# EasyEDA Pro project drive.epro, board PCB1
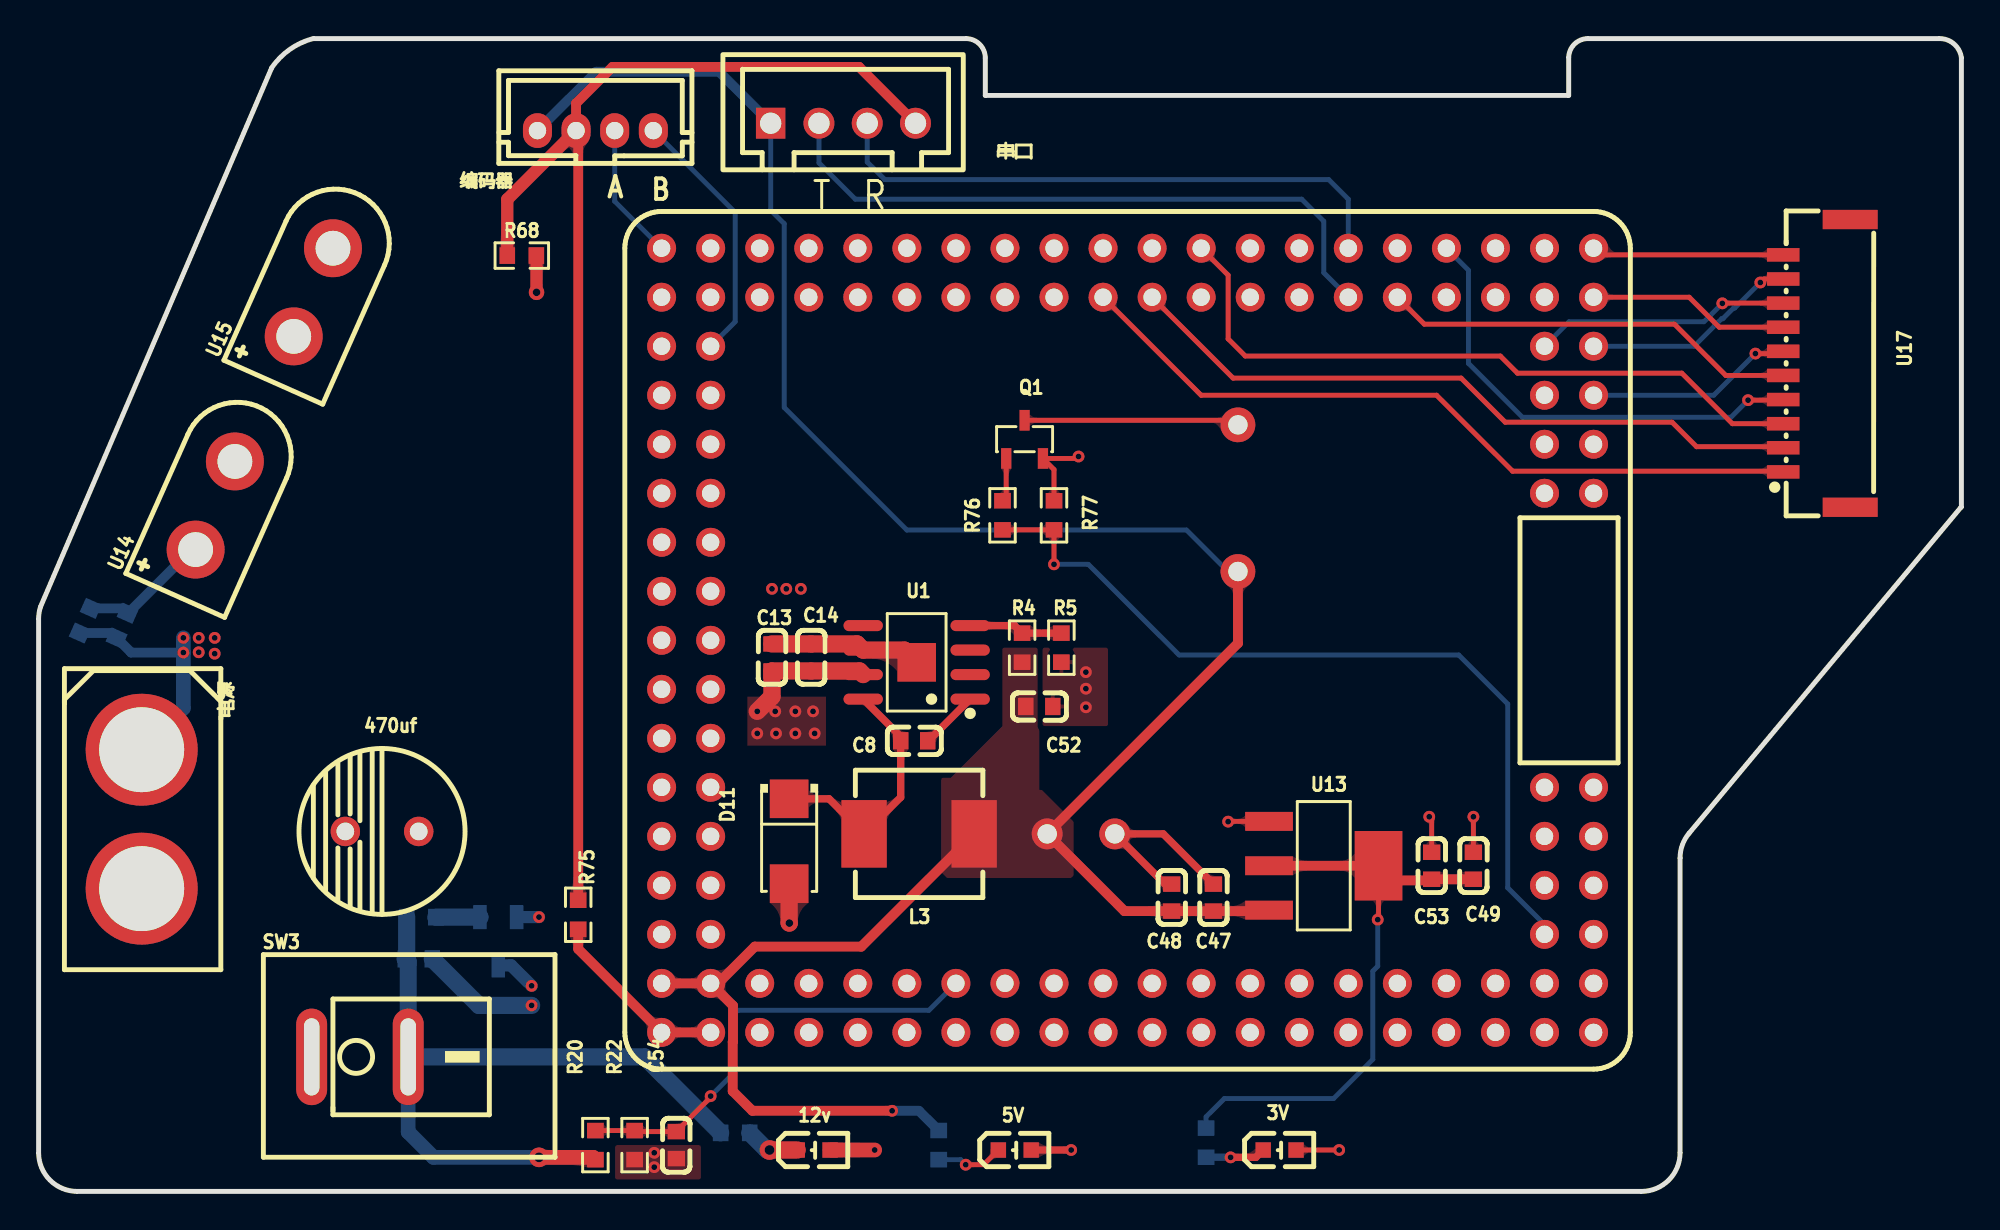
[diagram p2: board, top side]
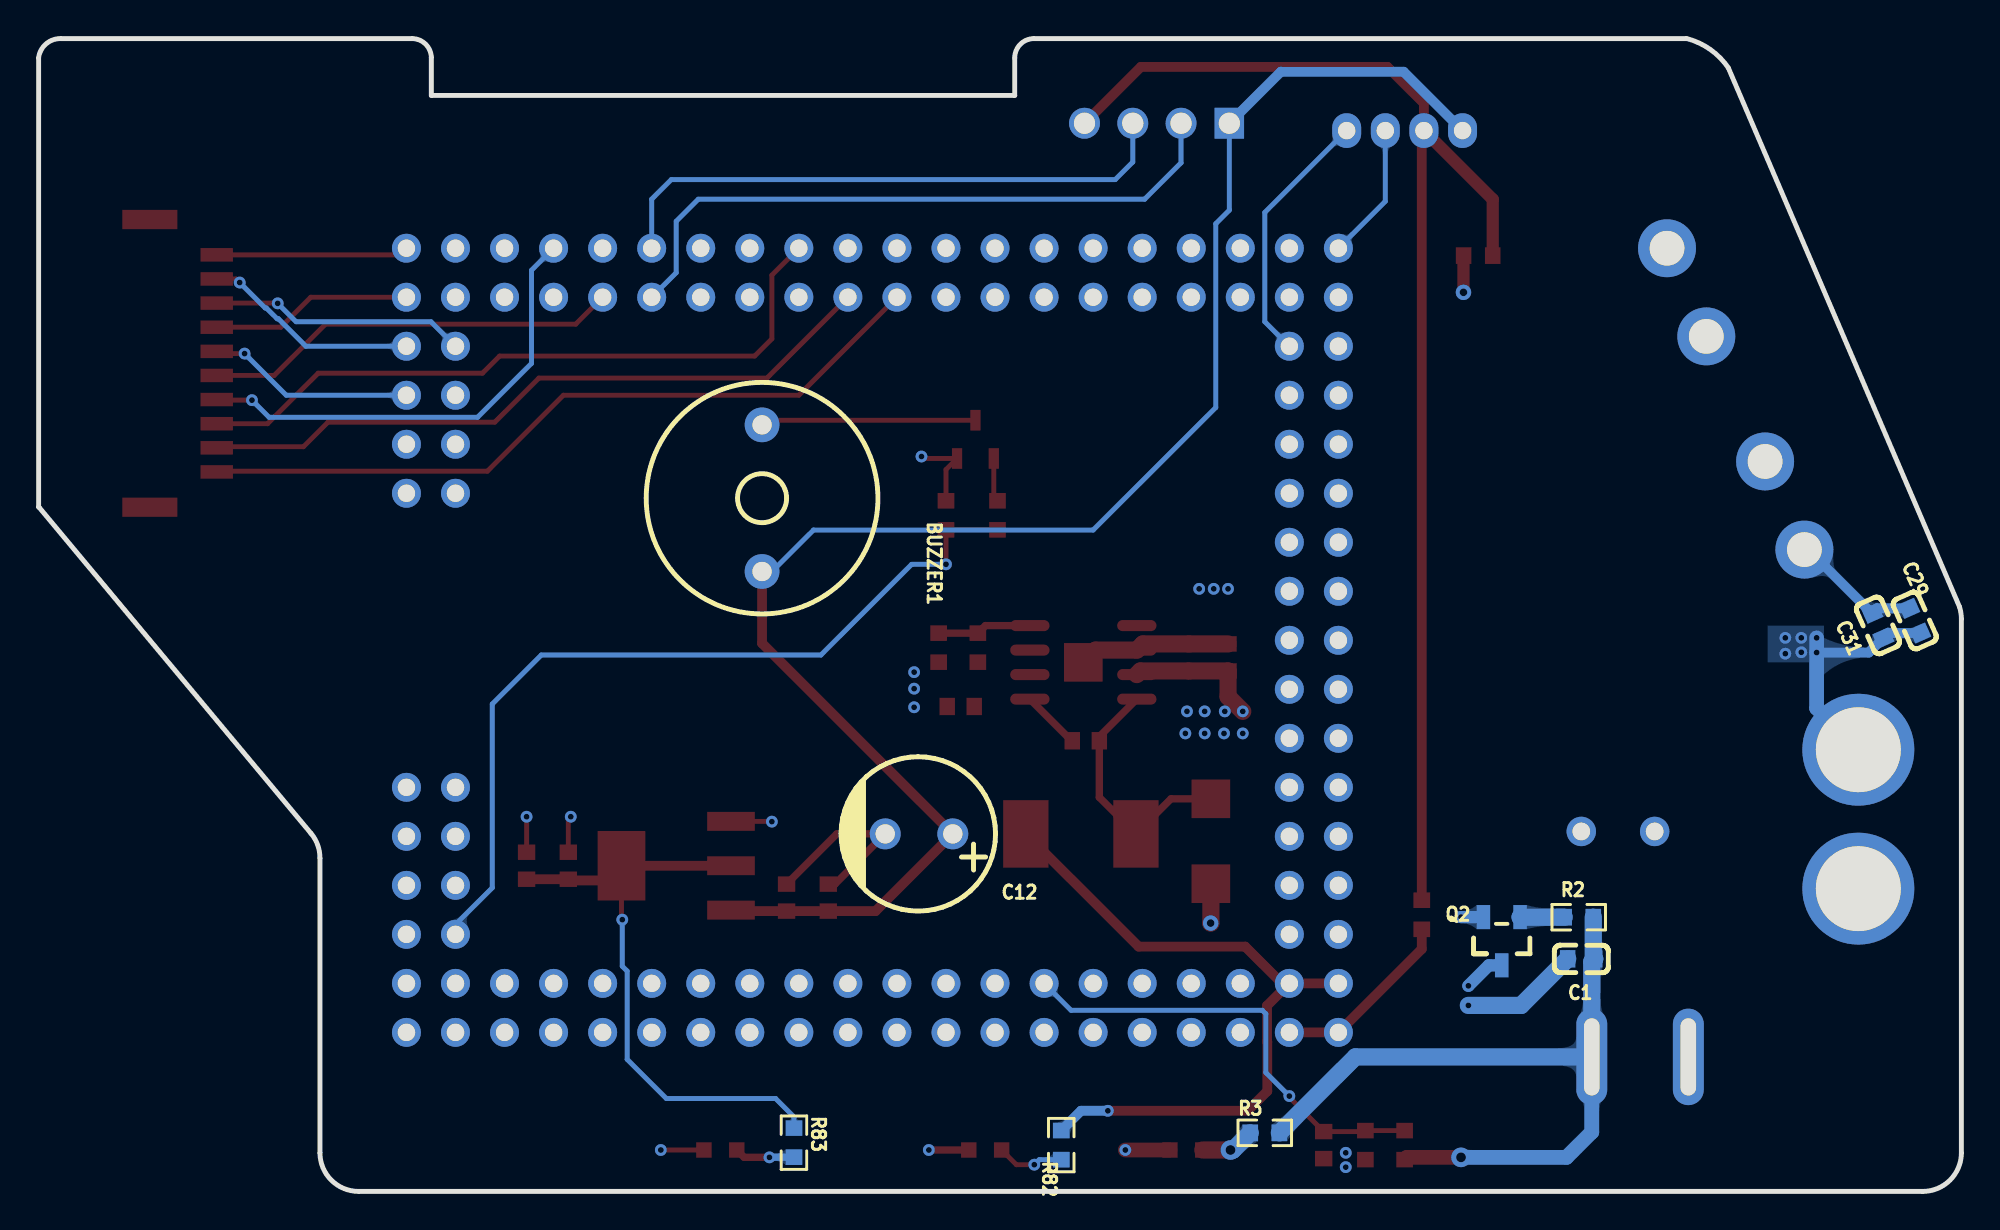
[diagram p3: board, bottom side, seen from below]

Outline 99.57 x 59.75 mm; copper layers: Top Layer, GND, PWR, Bottom Layer. Coordinates in mm from the lower left corner of the outline.
Outline path: 0,29.68 0,2 arc(0.59,0.59) 2,0 83,0 arc(84.41,0.59) 85,2 85,17.28 arc(85.12,17.96) 85.46,18.56 99.54,35.44 99.57,35.48 99.57,58.75 arc(99.19,59.47) 98.43,59.75 80.23,59.75 arc(79.53,59.46) 79.23,58.76 79.23,56.8 49.02,56.8 49.02,58.75 arc(48.73,59.45) 48.02,59.75 14.22,59.75 arc(13,59.18) 12.06,58.22 0.1,30.31 arc(0.03,30) 0,29.68
Stack: Top Layer 0.035mm 外层铜厚1oz / Dielectric1 0.2104mm 7628 RC49% 8.6mil / GND 0.035mm / Dielectric2 1.065mm 1.1mm H/HOZ Copper / PWR 0.0152mm 内层铜厚 / Dielectric3 0.2104mm 7628 RC49% 8.6mil / Bottom Layer 0.035mm 外层铜厚1oz

## Design rules (mm)
template: 自定义配置
spacing copperThickness1oz (default): track to track 0.102, other pairs 0.152 to 0.3
spacing copperThickness2oz: track to track 0.203, other pairs 0.152 to 0.3
track width copperThickness1oz (default): min 0.127, default 0.254, max 2.54
track width copperThickness2oz: min 0.203, default 0.254, max 2.54
differential pair differentialPair (default): width min 0.127, default 0.254, max 2.54; gap min 0.152, default 0.152
via viaSize (default): diameter min 0.5, default 0.61, max 10; hole min 0.3, default 0.305, max 6.3
net PGND uses pwr
net VCC_12V uses pwr
pour e67 uses copperRegion
pour e746 uses 正常

## Placement (name value [footprint] x y rotation side)
3V  LED3  [LED0603-R-RD_RED]  64.26 2.15 0 top
5V  LED5  [LED0603-R-RD_RED]  50.55 2.15 0 top
12v  电源指示  [LED0603-R-RD]  40.13 2.15 0 top
470uf  -  [470uF]  17.78 18.66 180 top
BUZZER1  2.7kHz  [BUZ-TH_BD12.0-P7.60-D0.6-FD]  62.11 35.93 90 bottom
C1  10uF  [C0603]  19.69 12.05 0 bottom
C8  100nF  [C0603]  45.34 23.36 180 top
C12  220uF  [CAP-TH_BD8.0-P3.50-D0.6-FD]  53.98 18.53 0 bottom
C13  10uF  [C0603]  37.98 27.67 270 top
C14  10uF  [C0603]  40.01 27.67 270 top
C29  10uF  [C0603]  2.42 29.58 246 bottom
C31  10uF  [C0603]  4.32 29.32 246 bottom
C47  10uF  [C0603]  60.84 15.23 270 top
C48  100nF  [C0603]  58.68 15.23 270 top
C49  100nF  [C0603]  74.3 16.88 270 top
C52  100nF  [C0603]  51.82 25.13 180 top
C53  10uF  [C0603]  72.14 16.88 270 top
C54  100nF  [C0603]  33.02 2.4 90 top
D11  SS34  [SMA_L4.3-W2.6-LS5.2-RD]  38.86 18.15 270 top
L3  15uH  [IND-SMD_L7.2-W6.6_GPSR07X0]  45.6 18.53 0 top
Q1  S8050  [SOT-23-3_L2.9-W1.3-P1.90-LS2.3-BR]  51.06 38.98 270 top
Q2  AO3400A  [SOT-23-3]  23.88 12.94 0 bottom
R2  10kΩ  [R0603]  19.81 14.21 180 bottom
R3  10kΩ  [R0603]  36.07 3.03 180 bottom
R4  10kΩ  [R0603]  50.93 28.18 270 top
R5  3.24kΩ  [R0603]  52.96 28.18 90 top
R20  10M  [R0603]  28.83 2.4 270 top
R22  100k  [R0603]  30.86 2.4 90 top
R68  0Ω  [R0603]  25.02 48.5 180 top
R75  0Ω  [R0603]  27.94 14.34 270 top
R76  1K  [R0603]  49.91 35.04 90 top
R77  10K  [R0603]  52.58 35.04 90 top
R82  10kΩ  [R0603]  46.61 2.4 270 bottom
R83  10kΩ  [R0603]  60.45 2.53 270 bottom
SW3  KCD11-2P-R  [SW-TH_2P-L15.0-W10.5-P5.00_KCD11-2P-R]  16.64 6.97 0 top
U1  TPS5430DDAR  [SOIC-8_L5.0-W4.0-P1.27-LS6.0-BL-EP2.0]  45.47 27.42 90 top
U2  TC264原理图  [TC264PCB封装]  50.29 25.77 90 top
U13  AMS1117-3.3  [SOT-223-4_L6.5-W3.5-P2.30-LS7.0-BR]  66.55 16.88 180 top
U14  XT30AW-M.G.Y  [CONN-TH_XT30AW-M.G.Y]  9.15 35.55 66 top
U15  XT30AW-M.G.Y  [CONN-TH_XT30AW-M.G.Y]  14.23 46.6 66 top
U17  HC-GH-10PLT  [CONN-SMD_10P-P1.25_HCTL_HC-GH-10PLT]  92.08 42.91 90 top
串口  ZX-XH2.54-4PZZ  [CONN-TH_4P-P2.50_4PIN]  41.66 55.36 0 top
电源  XT60  [CONN-TH_XT60]  5.34 19.29 270 top
编码器  PH2.0-LI-4P  [CONN-TH_4P-P2.00_HX20007-4A]  28.83 54.98 180 top

## Footprints (pads in the part's own frame, mm; a bottom-side part is the same pattern mirrored in y, then rotated)
470uF
  round 1.524 hole 0.914: 1(-1.9,0) 2(1.9,0)
BUZ-TH_BD12.0-P7.60-D0.6-FD
  round 1.8 hole 1: 1(-3.8,0) 2(3.8,0)
C0603
  rect 0.8x0.9 smd: 1(-0.7,0) 2(0.7,0)
CAP-TH_BD8.0-P3.50-D0.6-FD
  round 1.6 hole 1: 1(-1.75,0) 2(1.75,0)
CONN-SMD_10P-P1.25_HCTL_HC-GH-10PLT
  rect 0.7x1.68 smd: 1(-5.625,1.732) 2(-4.375,1.732) 3(-3.125,1.732) 4(-1.875,1.732) 5(-0.625,1.732) 6(0.625,1.732) 7(1.875,1.732) 8(3.125,1.732) 9(4.375,1.732) 10(5.625,1.732)
  rect 1x2.85 smd: 11(7.455,-1.732) 12(-7.455,-1.732)
CONN-TH_4P-P2.00_HX20007-4A
  oval 1.5x1.8 hole 0.9: 1(3,0) 2(1,0) 3(-1,0) 4(-3,0)
CONN-TH_4P-P2.50_4PIN
  rect 1.524x1.6 hole 1.1: 1(-3.75,0)
  round 1.6 hole 1.1: 2(-1.25,0) 3(1.25,0) 4(3.75,0)
CONN-TH_XT30AW-M.G.Y
  round 3 hole 1.8: 1(-2.5,0) 2(2.5,0)
CONN-TH_XT60
  round 5.8 hole 4.4: 1(-3.6,0) 2(3.6,0)
IND-SMD_L7.2-W6.6_GPSR07X0
  rect 2.35x3.5 smd: 1(-2.85,0) 2(2.85,0)
LED0603-R-RD
  rect 0.8x0.8 smd: 1(0.851,0) 2(-0.851,0)
LED0603-R-RD_RED
  rect 0.8x0.8 smd: 1(0.851,0) 2(-0.851,0)
R0603
  rect 0.806x0.864 smd: 1(-0.753,0) 2(0.753,0)
SMA_L4.3-W2.6-LS5.2-RD
  rect 2x2 smd: 1(-2.2,0) 2(2.2,0)
SOIC-8_L5.0-W4.0-P1.27-LS6.0-BL-EP2.0
  oval 0.574x2.038 smd: 1(-1.905,-2.769) 2(-0.635,-2.769) 3(0.635,-2.769) 4(1.905,-2.769) 5(1.905,2.769) 6(0.635,2.769) 7(-0.635,2.769) 8(-1.905,2.769)
  rect 2x2 smd: 9(0,0)
SOT-23-3
  rect 0.7x1.25 smd: 1(-1.026,-1.276) 2(0.874,-1.276) 3(-0.076,1.224)
SOT-23-3_L2.9-W1.3-P1.90-LS2.3-BR
  rect 1.07x0.532 smd: 1(0.99,-0.95) 2(0.99,0.95) 3(-0.99,0)
SOT-223-4_L6.5-W3.5-P2.30-LS7.0-BR
  rect 2.47x0.98 smd: 1(2.835,-2.3) 2(2.835,0) 3(2.835,2.3)
  rect 2.47x3.6 smd: 4(-2.835,0)
SW-TH_2P-L15.0-W10.5-P5.00_KCD11-2P-R
  oval 1.6x5 hole 0.8x4: 1(-2.5,0) 2(2.5,0)
TC264PCB封装
  round 1.5 hole 0.9: 1(-17.526,18.034) 2(-14.986,18.034) 3(-17.526,15.494) 4(-14.986,15.494) 5(-17.526,12.954) 6(-14.986,12.954) 7(-17.526,10.414) 8(-14.986,10.414) 9(-17.526,7.874) 10(-14.986,7.874) 11(-17.526,5.334) 12(-14.986,5.334) 13(-17.526,2.794) 14(-14.986,2.794) 15(-17.526,0.254) 16(-14.986,0.254) 17(-17.526,-2.286) 18(-14.986,-2.286) 19(-17.526,-4.826) 20(-14.986,-4.826) 21(-17.526,-7.366) 22(-14.986,-7.366) 23(-17.526,-9.906) 24(-14.986,-9.906) 25(-17.526,-12.446) 26(-14.986,-12.446) 27(-17.526,-14.986) 28(-14.986,-14.986) 29(-17.526,-17.526) 30(-14.986,-17.526) 31(-17.526,-20.066) 32(-14.986,-20.066) 33(-17.526,-22.606) 34(-14.986,-22.606) 35(-17.526,-25.146) 36(-14.986,-25.146) 38(-14.986,-27.686) 41(-12.446,-30.226) 42(-12.446,-27.686) 43(-9.906,-30.226) 44(-9.906,-27.686) 45(-7.366,-30.226) 46(-7.366,-27.686) 47(-4.826,-30.226) 48(-4.826,-27.686) 49(10.414,-27.686) 50(10.414,-30.226) 51(12.954,-27.686) 52(12.954,-30.226) 53(15.494,-27.686) 54(15.494,-30.226) 55(18.034,-27.686) 56(18.034,-30.226) 57(20.574,-30.226) 58(23.114,-30.226) 59(20.574,-27.686) 60(23.114,-27.686) 61(20.574,-25.146) 62(23.114,-25.146) 63(20.574,-22.606) 64(23.114,-22.606) 65(20.574,-20.066) 66(23.114,-20.066) 69(20.574,-14.986) 70(23.114,-14.986) 71(20.574,-12.446) 72(23.114,-12.446) 73(20.574,-9.906) 74(23.114,-9.906) 75(20.574,-7.366) 76(23.114,-7.366) 77(20.574,-4.826) 78(23.114,-4.826) 79(20.574,-2.286) 80(23.114,-2.286) 81(20.574,0.254) 82(23.114,0.254) 83(20.574,2.794) 84(23.114,2.794) 85(20.574,5.334) 86(23.114,5.334) 87(20.574,7.874) 88(23.114,7.874) 89(20.574,10.414) 90(23.114,10.414) 91(20.574,12.954) 92(23.114,12.954) 93(20.574,15.494) 94(23.114,15.494) 95(20.574,18.034) 96(23.114,18.034) 97(18.034,15.494) 98(18.034,18.034) 99(15.494,15.494) 100(15.494,18.034) 101(12.954,15.494) 102(12.954,18.034) 103(10.414,15.494) 104(10.414,18.034) 105(7.874,15.494) 106(7.874,18.034) 107(5.334,15.494) 108(5.334,18.034) 109(2.794,15.494) 110(2.794,18.034) 111(0.254,15.494) 112(0.254,18.034) 113(-2.286,15.494) 114(-2.286,18.034) 115(-4.826,15.494) 116(-4.826,18.034) 117(-7.366,15.494) 118(-7.366,18.034) 119(-9.906,15.494) 120(-9.906,18.034) 121(-12.446,15.494) 122(-12.446,18.034)
  round 1.5 hole 0.899x0.904: 37(-17.526,-27.686) 39(-17.526,-30.226) 40(-14.986,-30.226)
  round 1.5 hole 0.9x0.905: 67(20.574,-17.526) 68(23.114,-17.526)

## Nets
DGND: Q1.2 R68.2 R75.1 R77.2 串口.4 编码器.2
GND: R75.2 U2.1 U2.3
PGND: 3V.1 5V.1 12v.1 470uf.2 C1.2 C12.2 C13.1 C14.1 C29.2 C31.2 C47.1 C48.1 C49.1 C52.1 C53.1 C54.1 D11.2 Q2.2 Q2.3 R5.1 R22.1 R68.1 U1.6 U1.9 U13.1 U14.2 U15.2 电源.1
VCC_3V: C49.2 C53.2 R83.1 U13.2 U13.4
VCC_5V: BUZZER1.1 C12.1 C47.2 C48.2 C52.2 L3.2 R4.2 R82.1 U2.2 U2.4 U13.3 串口.1 编码器.1
VCC_12V: 470uf.1 C1.1 C13.2 C14.2 C29.1 C31.1 R2.2 R3.2 R20.2 SW3.2 U1.7 U14.1 U15.1
15.0: U2.58 U17.10
BEEP: R76.1 R77.1 U2.42
ENCODER_A: U2.96 编码器.3
ENCODER_B: U2.97 编码器.4
MOTOR_DIR: U2.74 U17.3
MVCC: SW3.1 电源.2
PIN_SERVO: U2.77 U17.1
PIN_SPEED: U2.75 U17.2
SPI_CS_PIN: U2.56 U17.9
SPI_MISO: U2.55 U17.8
SPI_MOSI: U2.57 U17.7
SPI_SCK: U2.54 U17.6
UART0_RX_P14_1: U2.68 串口.3
UART0_TX_P14_0: U2.67 串口.2
UART3_RX_P15_7: U2.65 U17.5
UART3_TX_P15_6: U2.64 U17.4
VOLTAGE_SAMPLING: C54.2 R20.1 R22.2 U2.14
$1N2415: BUZZER1.2 Q1.3
$1N2515: Q1.1 R76.2
$1N4319: C8.2 D11.1 L3.1 U1.8
$1N4320: R4.1 R5.2 U1.4
$1N4323: C8.1 U1.1
$1N4332: 12v.2 R3.1
$1N4334: 3V.2 R83.2
$1N4338: 5V.2 R82.2
$1N12038: Q2.1 R2.1

Pads without a net: U1 2 3 5; U2 5 6 7 8 9 10 11 12 13 15 16 17 18 19 20 21 22 23 24 25 26 27 28 29 30 31 32 33 34 35 36 37 38 39 40 41 43 44 45 46 47 48 49 50 51 52 53 59 60 61 62 63 66 69 70 71 72 73 76 78 79 80 81 82 83 84 85 86 87 88 89 90 91 92 93 94 95 98 99 100 101 102 103 104 105 106 107 108 109 110 111 112 113 114 115 116 117 118 119 120 121 122; U17 11 12

## Via types
v1: diameter 0.61, hole 0.305, Top Layer to Bottom Layer, 42 vias
v2: diameter 0.8, hole 0.4, Top Layer to Bottom Layer, 2 vias
v3: diameter 1.016, hole 0.508, Top Layer to Bottom Layer, 2 vias

## Routing (per net, layer and track width the routed paths; a pad name or vN(x,y) marks a point on that pad's centre or on a via; arc(x,y) is an arc through that point)
DGND: length 98.2
  Top Layer w0.254: v1(53.85,38.09) 53.75,37.99 Q1.2 52.58,37.41 R77.2
  Top Layer w0.508: 串口.4 42.49,58.28 29.72,58.28 27.83,56.39 27.83,54.98 27.94,54.87 R75.1
  Top Layer w0.635: R68.2 24.27,51.41 27.83,54.98
  GND w0.254: 串口.4 52.58,55.36 53.85,54.09 v1(53.85,38.09)
GND: length 9.7
  Top Layer w0.508: U2.3 U2.1 27.94,12.56 R75.2
PGND: length 61.5
  Top Layer w0.254: 3V.1 v1(67.35,2.15) ; U13.1 61.61,19.18 v1(61.6,19.16) ; v1(74.3,19.42) 74.3,19.42 C49.1 ; C53.1 72.14,19.29 v1(72.01,19.42)
  Top Layer w0.381: C48.1 58.33,15.93 C12.2 58.23,18.53 C47.1 ; 5V.1 v1(53.47,2.15)
  Top Layer w0.635: R68.1 25.78,48.49 v2(25.78,46.6)
  Top Layer w0.762: 12v.1 v1(43.29,2.15)
  Top Layer w0.889: D11.2 38.86,13.92 v2(38.88,13.91) ; C13.1 C14.1 42.38,28.37 U1.6 44.83,28.05 44.97,27.92
  GND w1.016: 5.72,23.27 8.29,25.84 v1(8.29,27.94)
  Bottom Layer w0.508: C29.2 3.78,28.94 C31.2 4.79,27.93 v1(7.5,27.93)
  Bottom Layer w0.635: v1(25.53,10.66) 24.47,11.72 Q2.3 ; Q2.2 v1(25.91,14.22)
  Bottom Layer w0.762: v1(7.5,28.69) v1(7.5,27.93) 7.5,25.05 5.34,22.89
  Bottom Layer w0.889: C1.2 22.8,9.64 v1(25.53,9.64)
  vias: v1(8.29,28.69) v1(9.12,28.69) v1(9.12,27.87) v1(31.88,2) v1(31.88,1.26) v1(37.98,31.23) v1(38.72,31.23) v1(39.47,31.23) v1(54.23,26.91) v1(54.23,26.06) v1(54.23,25.09)
VCC_3V: length 31.5
  Top Layer w0.254: U13.4 69.39,14.12 v1(69.34,14.08)
  Top Layer w0.508: U13.2 U13.4 70.15,16.12 72.08,16.12 C53.2 C49.2
  Bottom Layer w0.254: v1(69.34,14.08) 69.34,11.67 69.09,11.42 69.09,6.84 67.06,4.81 61.4,4.81 60.45,3.86 R83.1
VCC_5V: length 124.3
  Top Layer w0.508: v1(44.2,4.18) 36.96,4.18 35.94,5.19 35.94,7.75 35.96,7.76 35.96,9.63 U2.4 ; 48.45,18.53 42.6,12.69 37.09,12.69 35.18,10.78 U2.4 ; U2.4 U2.2 ; U13.3 63.66,14.53 C47.2 C48.2 56.23,14.53 C12.1 62.11,28.41 BUZZER1.1
  Bottom Layer w0.254: 串口.1 37.91,50.85 38.61,50.15 38.61,40.63 44.96,34.28 59.44,34.28 61.59,32.13 BUZZER1.1
  Bottom Layer w0.508: 25.83,54.98 28.88,58.03 35.24,58.03 串口.1 ; R82.1 45.59,4.18 v1(44.2,4.18)
VCC_12V: length 90.9
  Top Layer w0.762: R20.2 28.71,1.77 v3(25.91,1.77)
  Top Layer w0.889: v1(37.21,24.88) 37.98,25.64 C13.2 C14.2 42.51,26.97 U1.7
  PWR w1.016: 19.68,21.51 470uf.1
  PWR w1.27: U14.1 12.7,33.26 16,36.56 16,41.52 U15.1 ; 7.93,33.26 19.68,21.51
  Bottom Layer w0.508: C29.1 4.35,30.22 C31.1 4.63,29.96 7.93,33.26
  Bottom Layer w0.762: v3(25.91,1.77) 20.45,1.77 19.14,3.07 SW3.2
  Bottom Layer w0.889: R2.2 19.06,12.13 C1.1 19.14,11.9 SW3.2 31.38,6.97 R3.2
  vias: v1(37.21,23.74) v1(38.14,24.88) v1(38.19,23.74) v1(39.19,24.88) v1(39.19,23.74) v1(40.1,24.88) v1(40.19,23.74)
15.0: length 10
  Top Layer w0.254: U2.58 80.86,48.54 U17.10
BEEP: length 43.7
  Top Layer w0.254: v1(52.58,32.5) R77.1 R76.1
  Bottom Layer w0.254: U2.42 77.98,13.83 76.08,15.73 76.08,25.26 73.54,27.8 59.06,27.8 54.36,32.5 v1(52.58,32.5)
ENCODER_A: length 7.1
  Bottom Layer w0.254: 编码器.3 29.83,51.31 U2.96
ENCODER_B: length 13.5
  Bottom Layer w0.254: U2.97 36.07,45.07 36.07,50.74 编码器.4
MOTOR_DIR: length 35.8
  Top Layer w0.254: U2.74 61.6,47.48 61.6,44.18 62.49,43.29 75.69,43.29 76.58,42.41 85.09,42.41 87.71,39.79 U17.3
PIN_SERVO: length 38.9
  Top Layer w0.254: 90.3,37.33 76.33,37.33 72.39,41.26 60.2,41.26 U2.77
PIN_SPEED: length 35.9
  Top Layer w0.254: U2.75 61.85,42.15 73.66,42.15 75.95,39.87 84.58,39.87 85.85,38.59 90.29,38.59 U17.2
SPI_CS_PIN: length 11.3
  Top Layer w0.254: v1(89.16,47.1) 89.34,47.29 U17.9
  Bottom Layer w0.254: U2.56 85.73,43.8 87.15,45.23 87.22,45.23 87.77,45.78 87.84,45.78 v1(89.16,47.1)
SPI_MISO: length 13.3
  Top Layer w0.254: v1(87.19,46.02) 87.2,46.04 U17.8
  Bottom Layer w0.254: U2.55 79.25,45.07 86.24,45.07 v1(87.19,46.02)
SPI_MOSI: length 10.5
  Top Layer w0.254: U17.7 87.03,44.79 85.47,46.34 U2.57
SPI_SCK: length 10.8
  Top Layer w0.254: v1(88.9,43.42) 90.23,43.42 U17.6
  Bottom Layer w0.254: U2.54 86.74,41.26 v1(88.9,43.42)
UART0_RX_P14_1: length 30.3
  Bottom Layer w0.254: U2.68 67.82,51.42 66.8,52.44 43.82,52.44 42.91,53.35 串口.3
UART0_TX_P14_0: length 33.9
  Bottom Layer w0.254: 串口.2 40.41,53.31 42.29,51.42 65.41,51.42 66.55,50.28 66.55,47.61 U2.67
UART3_RX_P15_7: length 21.7
  Top Layer w0.254: U17.5 87.37,42.29 84.71,44.95 71.76,44.95 U2.65
UART3_TX_P15_6: length 24.3
  Top Layer w0.254: v1(88.52,41.01) 90.31,41.01 U17.4
  Bottom Layer w0.254: v1(88.52,41.01) 87.63,40.12 76.84,40.12 74.04,42.91 74.04,47.74 U2.64
VOLTAGE_SAMPLING: length 23.7
  Top Layer w0.254: v1(34.8,4.94) 34.8,4.88 C54.2 30.92,3.1 R22.2 R20.1
  Bottom Layer w0.254: U2.14 46.1,9.38 36.2,9.38 36.02,9.21 36.02,6.16 v1(34.8,4.94)
$1N2415: length 11.1
  Top Layer w0.254: BUZZER1.2 61.87,39.97 Q1.3
$1N2515: length 2.3
  Top Layer w0.254: R76.2 50.11,35.99 Q1.1
$1N4319: length 13.2
  Top Layer w0.381: U1.8 44.64,23.57 C8.2 44.64,20.42 L3.1 40.93,20.35 D11.1
$1N4320: length 4.9
  Top Layer w0.381: R5.2 R4.1 50.54,29.32 U1.4
$1N4323: length 3.1
  Top Layer w0.381: C8.1 46.08,23.36 U1.1
$1N4332: length 2.8
  Top Layer w0.889: v3(37.85,2.15) 12v.2
  Bottom Layer w0.889: R3.1 37.71,2.15 v3(37.85,2.15)
$1N4334: length 3.1
  Top Layer w0.381: v1(61.72,1.77) 63.03,1.77 3V.2
  Bottom Layer w0.381: v1(61.72,1.77) 61.72,1.77 R83.2
$1N4338: length 3.5
  Top Layer w0.254: v1(48.01,1.38) 48.94,1.38 5V.2
  Bottom Layer w0.254: v1(48.01,1.38) 47.75,1.65 R82.2
$1N12038: length 2.3
  Bottom Layer w0.889: Q2.1 22.85,14.21 R2.1

## Copper pours and planes (outline as drawn; the poured copper is in the pictures)
PGND on Top Layer: 29.85,2.4 34.29,2.4 34.29,0.62 29.85,0.62
PGND on Top Layer: 51.99,28.18 55.37,28.18 55.37,24.12 51.99,24.12
PGND on Bottom Layer: 7.11,29.32 10.04,29.32 10.04,27.42 7.11,27.42
PGND on GND: -9.78,64.38 111,64.38 111,-4.08 -9.78,-4.08
PGND on GND: 7.88,40.37 12.45,40.37 12.45,35.77 7.88,35.77
VCC_5V on Top Layer: 49.91,28.18 51.69,28.18 51.82,28.05 51.82,20.81 51.95,20.81 53.6,19.16 53.6,16.37 53.47,16.24 47.04,16.24 46.74,16.55 46.74,21.43 47.23,21.43 49.91,24.11
VCC_12V on Top Layer: 36.71,25.64 40.77,25.64 40.77,23.1 36.71,23.1
VCC_12V on PWR: 11.13,46.53 15.66,46.53 15.66,41.87 11.13,41.87
VCC_12V on PWR: 17.27,3.54 17.15,3.42 23.7,3.42 25.15,18.4 30.23,19.8 40.56,23.27 40.56,25.68 17.58,25.68
VCC_12V on PWR: 6.03,35.43 10.67,35.43 10.67,31.23 6.03,31.23
MVCC on PWR: 1.34,12.08 1.92,11.49 8.69,11.49 11.64,8.54 11.64,1.77 16.51,1.77 16.64,1.64 16.64,12.94 10.29,19.29 1.34,19.29

Small or netless copper shapes (teardrops, artwork), in the pictures only: 104 on Top Layer, 44 on Bottom Layer, 1 on GND, 4 on PWR

## Text on the board
Top Silkscreen Layer: A | B | T | R
